# Altium schematic sheet efm32_1.SchDoc
size Letter
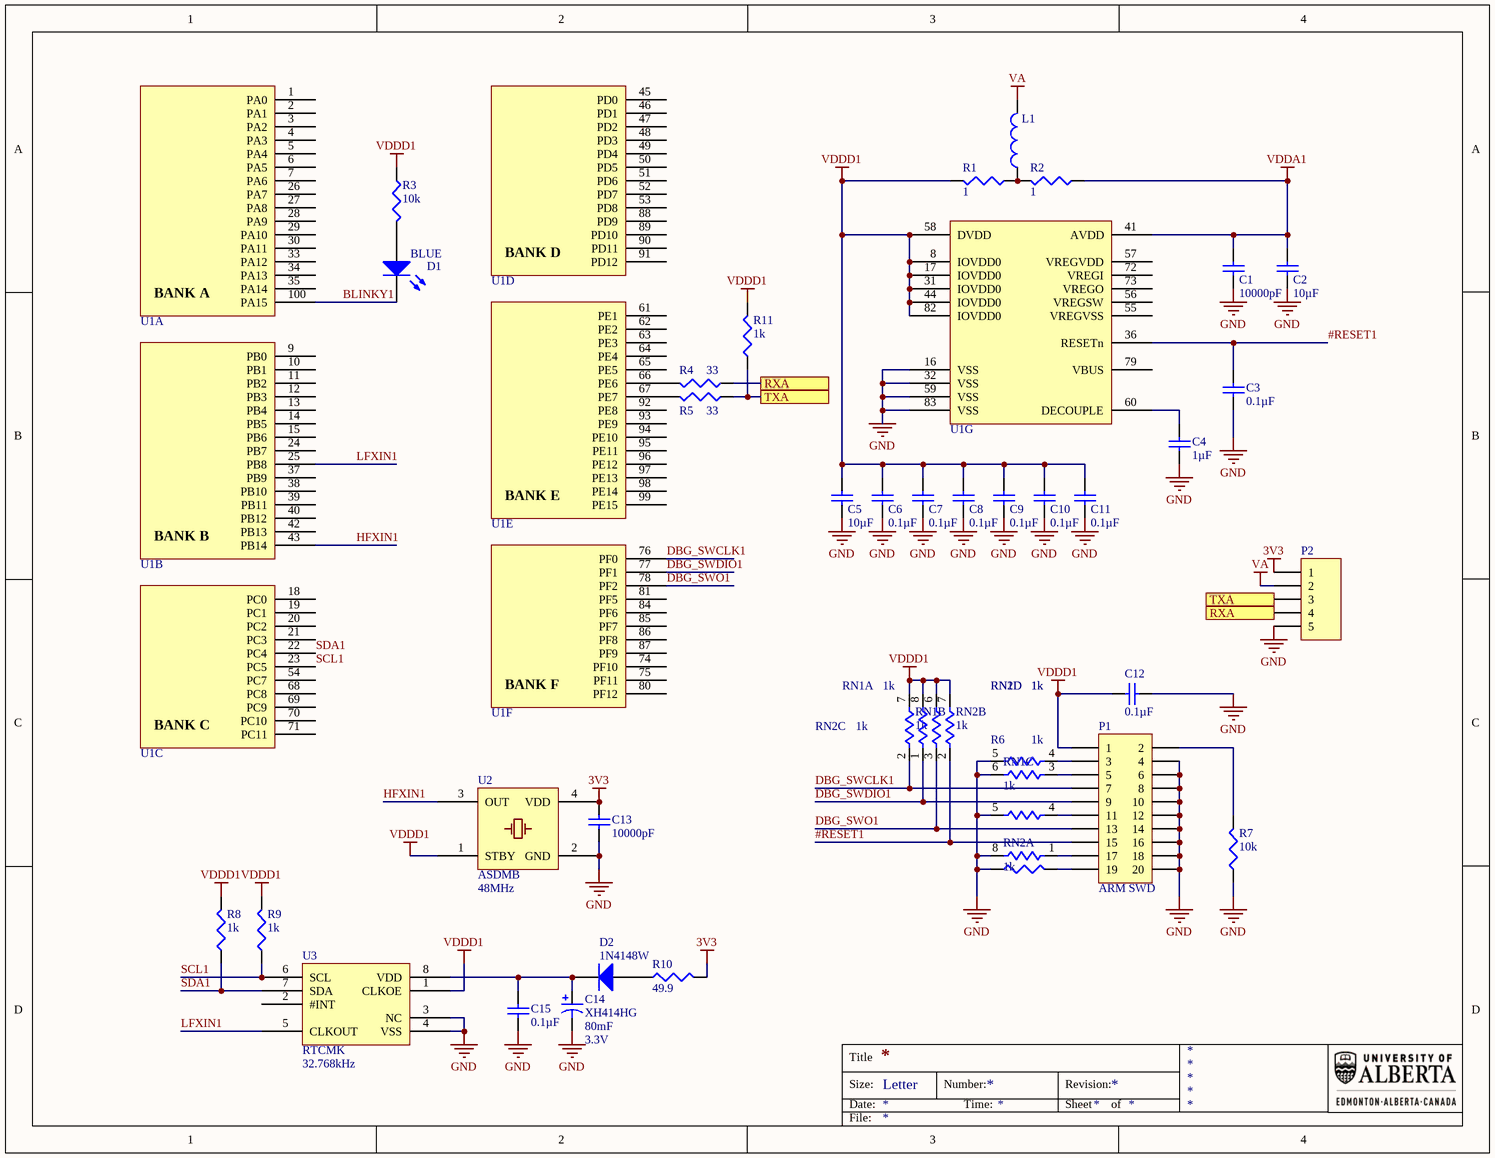
[diagram p0: efm32_1.SchDoc]

## Parts
C1  value 10000pF  [TDK-CGA3E]  (hidden comment: Cap)
C2  value 10µF  [TDK-CGA5L]  (hidden comment: Cap)
C3  value 0.1µF  [TDK-CGA3E]  (hidden comment: Cap)
C4  value 1µF  [TDK-CGA3E]  (hidden comment: Cap)
C5  value 10µF  [TDK-CGA5L]  (hidden comment: Cap)
C6  value 0.1µF  [TDK-CGA3E]  (hidden comment: Cap)
C7  value 0.1µF  [TDK-CGA3E]  (hidden comment: Cap)
C8  value 0.1µF  [TDK-CGA3E]  (hidden comment: Cap)
C9  value 0.1µF  [TDK-CGA3E]  (hidden comment: Cap)
C10  value 0.1µF  [TDK-CGA3E]  (hidden comment: Cap)
C11  value 0.1µF  [TDK-CGA3E]  (hidden comment: Cap)
C12  value 0.1µF  [TDK-CGA3E]  (hidden comment: Cap)
C13  value 10000pF  [TDK-CGA3E]  (hidden comment: Cap)
C14  XH414HG  value 80mF  Voltage - Rated: 3.3V  [SKI-XH414HG-IV01E]
C15  value 0.1µF  [TDK-CGA3E]  (hidden comment: Cap)
D1  value BLUE  [WL-150060XS75000]  (hidden comment: LED)
D2  1N4148W  [DIOD-SOD123]
L1  Inductor  [TDK-MPX1608]  (value not drawn)
P1  Header 10x2  [SLN-GRPB102]  (value not drawn)
P2  319-10-105-30-054000  [319-10-105-30-054000]  (value not drawn)
R1  value 1  [VSH-0603MCT]  (hidden comment: Res3)
R2  value 1  [VSH-0603MCT]  (hidden comment: Res3)
R3  value 10k  [PANA-ERJ3EK]  (hidden comment: Res3)
R4  value 33  [PANA-ERJ3EK]  (hidden comment: Res3)
R5  value 33  [PANA-ERJ3EK]  (hidden comment: Res3)
R6  value 1k  [PANA-ERJ3EK]  (hidden comment: Res3)
R7  value 10k  [PANA-ERJ3EK]  (hidden comment: Res3)
R8  value 1k  [PANA-ERJ3EK]  (hidden comment: Res3)
R9  value 1k  [PANA-ERJ3EK]  (hidden comment: Res3)
R10  value 49.9  [PANA-ERJ3EK]  (hidden comment: Res3)
R11  value 1k  [PANA-ERJ3EK]  (hidden comment: Res3)
RN1  value 1k  [PANA-EXB1206]  (hidden comment: Res4 Pack1)  (parts A,B,C,D of 4)
RN2  value 1k  [PANA-EXB1206]  (hidden comment: Res4 Pack1)  (parts A,B,C,D of 4)
U1  EFM32GG11B8  [SI-TQFP100]  (value not drawn)  (parts A,B,C,D,E,F,G of 7)
U2  ASDMB  value 48MHz  [ABR-ASDMB]
U3  RTCMK  value 32.768kHz  [ABR-RTCMK]

## Ports
RXA, TXA

## Nets
3V3: C13.2 P2.1 R10.2 U2.4(VDD)
GND: C1.1 C2.1 C3.2 C4.1 C5.1 C6.1 C7.1 C8.1 C9.1 C10.1 C11.1 C12.2 C13.1 C14.2 C15.1 P1.4 P1.6 P1.8 P1.10 P1.12 P1.14 P1.16 P1.18 P1.20 P2.5 R6.2 R7.1 RN1.5 RN1.6 RN2.5 RN2.8 U1.16(VSS) U1.32(VSS) U1.59(VSS) U1.83(VSS) U2.2(GND) U3.3(NC) U3.4(VSS)
VA: L1.2 P2.2
VDDA1: C1.2 C2.2 R2.1 U1.41(AVDD)
VDDD1: C5.2 C6.2 C7.2 C8.2 C9.2 C10.2 C11.2 C12.1 P1.1 R1.2 R3.2 R8.2 R9.2 R11.2 RN1.7 RN1.8 RN2.6 RN2.7 U1.8(IOVDD0) U1.17(IOVDD0) U1.31(IOVDD0) U1.44(IOVDD0) U1.58(DVDD) U1.82(IOVDD0) U2.1(STBY) U3.1(CLKOE)
#RESET1: C3.1 P1.15 RN2.2 U1.36(RESETn)
BLINKY1: D1.2(K) U1.100(PA15)
DBG_SWCLK1: P1.7 RN1.2 U1.76(PF0)
DBG_SWDIO1: P1.9 RN1.1 U1.77(PF1)
DBG_SWO1: P1.13 RN2.3 U1.78(PF2)
HFXIN1: U1.43(PB14) U2.3(OUT)
LFXIN1: U1.25(PB8) U3.5(CLKOUT)
RXA: P2.4 R4.1 ; port RXA
SCL1: R9.1 U1.23(PC5) U3.6(SCL)
SDA1: R8.1 U1.22(PC4) U3.7(SDA)
TXA: P2.3 R5.1 R11.1 ; port TXA
NetC4_2: C4.2 U1.60(DECOUPLE)
NetC14_1: C14.1 C15.2 D2.2(K) U3.8(VDD)
NetD1_1: D1.1(A) R3.1
NetD2_1: D2.1(A) R10.1
NetL1_1: L1.1 R1.1 R2.2
NetP1_2: P1.2 R7.2
NetP1_3: P1.3 RN1.4
NetP1_5: P1.5 RN1.3
NetP1_11: P1.11 RN2.4
NetP1_17: P1.17 RN2.1
NetP1_19: P1.19 R6.1
NetR4_2: R4.2 U1.66(PE6)
NetR5_2: R5.2 U1.67(PE7)

Not connected (* = marked no-connect by the designer): U1 1(PA0) 2(PA1) 3(PA2) 4(PA3) 5(PA4) 6(PA5) 7(PA6) 9(PB0) 10(PB1) 11(PB2) 12(PB3) 13(PB4) 14(PB5) 15(PB6) 18(PC0) 19(PC1) 20(PC2) 21(PC3) 24(PB7) 26(PA7) 27(PA8) 28(PA9) 29(PA10) 30(PA11) 33(PA12) 34(PA13) 35(PA14) 37(PB9) 38(PB10) 39(PB11) 40(PB12) 42(PB13) 45(PD0) 46(PD1) 47(PD2) 48(PD3) 49(PD4) 50(PD5) 51(PD6) 52(PD7) 53(PD8) 54(PC7) 55(VREGVSS) 56(VREGSW) 57(VREGVDD) 61(PE1) 62(PE2) 63(PE3) 64(PE4) 65(PE5) 68(PC8) 69(PC9) 70(PC10) 71(PC11) 72(VREGI) 73(VREGO) 74(PF10) 75(PF11) 79(VBUS) 80(PF12) 81(PF5) 84(PF6) 85(PF7) 86(PF8) 87(PF9) 88(PD9) 89(PD10) 90(PD11) 91(PD12) 92(PE8) 93(PE9) 94(PE10) 95(PE11) 96(PE12) 97(PE13) 98(PE14) 99(PE15); U3 2(#INT)

## Notes on the sheet
- (near P1) ARM SWD
- Title
- Size:
- Date:
- Letter
- Number:
- Time:
- Revision:
- Sheet
- of
- File:
- (in symbol PU-SI-00008, part A) BANK A
- (in symbol PU-SI-00008, part B) BANK B
- (in symbol PU-SI-00008, part C) BANK C
- (in symbol PU-SI-00008, part D) BANK D
- (in symbol PU-SI-00008, part E) BANK E
- (in symbol PU-SI-00008, part F) BANK F

## Library data of the parts
C1 C13 = PC-TDK-01883: CAP CER 10000PF 100V C0G 0603; Manufacturer Part Number: CGA3E1C0G2A103J080AC; Index: 1883; Designator: C?; Tolerance: ±5%; Temperature Coefficient: NP0; Published: 3/16/2016; LatestRevisionDate: 3/16/2016; LatestRevisionNote: ...; PackageReference: 0603 (1608 Metric); Publisher: AlbertaSat; PackageDescription: Radial Cap, Thru-Hole; 2 Leads; 0.3 in Pin Spacing; Part Number: PC-TDK-01883; Supplier Part Number 1: 445-172688-1-ND; Supplier 1: Digi-key; Supplier Link: http://www.digikey.ca/product-search/en?keywords=445-172688-1-ND; Voltage - Rated: 100V; Applications: Automotive
C2 C5 = PC-TDK-02917: CAP CER 10UF 25V X7R 1206; Manufacturer Part Number: CGA5L1X7R1E106K160AC; Index: 2917; Tolerance: ±10%; Published: 3/16/2016; LatestRevisionDate: 3/16/2016; LatestRevisionNote: ...; PackageReference: 1206 (3216 Metric); Publisher: AlbertaSat; PackageDescription: Radial Cap, Thru-Hole; 2 Leads; 0.3 in Pin Spacing; Part Number: PC-TDK-02917; Supplier Part Number 1: 445-6990-1-ND; Supplier 1: Digi-key; Supplier Link: http://www.digikey.ca/product-search/en?keywords=445-6990-1-ND; Voltage - Rated: 25V; Temperature Coefficient: X7R; Applications: Automotive
C3 C6-C12 C15 = PC-TDK-02272: CAP CER 0.1UF 50V X8R 0603; Manufacturer Part Number: CGA3E3X8R1H104K080AB; Index: 2272; Tolerance: ±10%; Published: 3/16/2016; LatestRevisionDate: 3/16/2016; LatestRevisionNote: ...; PackageReference: 0603 (1608 Metric); Publisher: AlbertaSat; PackageDescription: Radial Cap, Thru-Hole; 2 Leads; 0.3 in Pin Spacing; Part Number: PC-TDK-02272; Supplier Part Number 1: 445-12606-1-ND; Supplier 1: Digi-key; Supplier Link: http://www.digikey.ca/product-search/en?keywords=445-12606-1-ND; Voltage - Rated: 50V; Temperature Coefficient: X8R; Applications: Automotive
C4 = PC-TDK-02603: CAP CER 1UF 25V X7R 0603; Manufacturer Part Number: CGA3E1X7R1E105K080AC; Index: 2603; Designator: C?; Tolerance: ±10%; Published: 3/16/2016; LatestRevisionDate: 3/16/2016; LatestRevisionNote: ...; PackageReference: 0603 (1608 Metric); Publisher: AlbertaSat; PackageDescription: Radial Cap, Thru-Hole; 2 Leads; 0.3 in Pin Spacing; Part Number: PC-TDK-02603; Supplier Part Number 1: 445-6931-1-ND; Supplier 1: Digi-key; Supplier Link: http://www.digikey.ca/product-search/en?keywords=445-6931-1-ND; Voltage - Rated: 25V; Temperature Coefficient: X7R; Applications: Automotive
C14 = PC-SKI-00001: CAP 80MF 3.3V SURFACE MOUNT; Manufacturer Part Number: XH414HG-IV01E; Index: 1; Designator: C?; Published: 2018-04-25; LatestRevisionDate: 2018-04-25; LatestRevisionNote: ...; PackageReference: 0.189" Dia (4.80mm); Publisher: AlbertaSat; PackageDescription: Polarized Capacitor (Radial); 2 Leads; Part Number: PC-SKI-00001; Supplier Part Number 1: 728-1050-1-ND; Supplier 1: Digi-key; Supplier Part Number 2: 628-XH414HG-IV01E; Supplier 2: Mouser; Supplier Link: #https://www.digikey.ca/product-detail/en/seiko-instruments/XH414HG-IV01E/728-1050-1-ND/1889211#
D1 = 4: LED BLUE CLEAR 0603 SMD; Part Number: 4; Manufacturer Part Number: 150060BS75000; Designator: D?; Brightness: 145mcd; Published: 8-Jun-2000; LatestRevisionDate: 08-Jul-2005; LatestRevisionNote: Mech Layer 1 removed.; PackageReference: WL-150060XS75000; Publisher: Altium Limited; PackageDescription: LED; 2 Leads; Supplier Part Number 1: 732-4966-1-ND; Supplier 1: Digi-Key; Supplier Link: http://www.digikey.ca/product-search/en?keywords=732-4966-1-ND
D2 = 26: DIODE GEN PURP 100V 300MA SOD123; Part Number: 26; Manufacturer Part Number: 1N4148W-7-F; Designator: D?; Voltage - DC Reverse: 1.25V @ 150mA; Published: 8-Jun-2000; LatestRevisionDate: 17-Jul-2002; LatestRevisionNote: Re-released for DXP Platform.; PackageVersion: Sep-1996; PackageReference: DIOD-SOD123; Publisher: Altium Limited; PackageDescription: DO-214-AB/SMC; 2 C-Bend Leads; Body 7.9 x 5.9 mm, inc. leads (LxW); Code_JEDEC: DO-214-AB; Supplier Part Number 1: 1N4148W-FDICT-ND; Supplier 1: Digi-Key; Supplier Link: #https://www.digikey.ca/product-detail/en/diodes-incorporated/1N4148W-7-F/1N4148W-FDICT-ND/815280#; Voltage - Reverse Standoff (Typ): 100V; Current - Peak Pulse: 300mA
L1 = PL-TDK-02954: FERRITE BEAD 1 KOHM 0603 1LN; Manufacturer Part Number: MPZ1608S102ATD25; Code_IEC: 1608; Value: 1 kOhm @ 100MHz; Index: 2954; Designator: L?; Current - Rated: 800mA; Published: 7/8/2017; LatestRevisionDate: 7/8/2017; LatestRevisionNote: ...; PackageReference: 0603 (1608 Metric); Publisher: AlbertaSat; PackageDescription: Chip Inductor, 2-Leads, Body 1.60x0.80mm, IPC Low Density; Code_JEITA: 0603; Part Number: PL-TDK-02954; Supplier Part Number 1: 445-172890-1-ND; Supplier 1: Digi-key; Supplier Part Number 2: 810-MPZ1608S102ATD25; Supplier 2: Mouser; Supplier Link: #https://www.digikey.ca/product-detail/en/tdk-corporation/MPZ1608S102ATD25/445-172890-1-ND/5040521#; Applications: Automotive
P1 = PP-SLN-00022: CONN HEADER .050"" 20PS DL PCB AU; Manufacturer Part Number: GRPB102VWVN-RC; Index: 22; Designator: P?; Number of Positions: 20; LatestRevisionDate: 3/16/2016; LatestRevisionNote: ...; Publisher: AlbertaSat; Part Number: PP-SLN-00022; Supplier Part Number 1: S9015E-10-ND; Supplier 1: Digi-key; Published: 3/16/2016; PackageReference: SLN-GRPB102; PackageDescription: CONN HEADER .050"" 20PS DL PCB AU; Supplier Link: http://www.digikey.ca/product-search/en?keywords=S9015E-10-ND; Number of Rows: 2
P2 = PP-MMM-00002: LOW PROFILE SLC TARGET CONNECTOR; Index: 2; Designator: P?; LatestRevisionDate: 2018-05-10; LatestRevisionNote: ...; Publisher: AlbertaSat; Part Number: PP-MMM-00002; Manufacturer Part Number: 319-10-105-30-054000; Supplier Part Number 1: ED10781-ND; Supplier 1: Digi-key; Supplier Part Number 2: 575-3191010530054000; Supplier 2: Mouser; Published: 2018-05-10; Supplier Link: #https://www.digikey.ca/product-detail/en/mill-max-manufacturing-corp/319-10-105-30-054000/ED10781-ND/6243896#
R1 R2 = PR-VSH-00048: RES SMD 1 OHM 1% 1/8W 0603; Manufacturer Part Number: MCT06030C1008FP500; Index: 4; Designator: R?; Temperature Coefficient: ±50ppm/°C; Published: 3/14/2016; LatestRevisionDate: 3/14/2016; LatestRevisionNote: ...; PackageReference: 0603 (1608 Metric); Publisher: AlbertaSat; PackageDescription: Chip Resistor, 2-Leads, Body 1.55x0.85mm, IPC Low Density; Part Number: PR-VSH-00048; Supplier Part Number 1: MCT0603-1.00-CFCT-ND; Supplier 1: Digi-key; Supplier Link: http://www.digikey.ca/product-search/en?keywords=MCT0603-1.00-CFCT-ND; Tolerance: ±1%; Power - Rated: 1/8W; Applications: General Purpose
R3 R7 = 17203: RES SMD 10K OHM 1% 1/10W 0603; Part Number: 17203; Manufacturer Part Number: ERJ-3EKF1002V; Designator: R?; Power: 0.1W, 1/10W; Temperature Coefficient: ±100ppm/°C; Published: 8-Jun-2000; LatestRevisionDate: 29-May-2009; LatestRevisionNote: IPC-7351 Footprint Added.; PackageReference: 0603 (1608 Metric); Publisher: Altium Limited; PackageDescription: Chip Resistor, 2-Leads, Body 1.60x0.80mm, IPC Low Density; Supplier Part Number 1: P10.0KHCT-ND; Supplier 1: Digi-Key; Supplier Link: http://www.digikey.ca/product-search/en?keywords=P10.0KHCT-ND; Tolerance: ±1%
R4 R5 = 13588: RES SMD 33 OHM 1% 1/10W 0603; Part Number: 13588; Manufacturer Part Number: ERJ-3EKF33R0V; Designator: R?; Power: 0.1W, 1/10W; Temperature Coefficient: ±100ppm/°C; Published: 8-Jun-2000; LatestRevisionDate: 29-May-2009; LatestRevisionNote: IPC-7351 Footprint Added.; PackageReference: 0603 (1608 Metric); Publisher: Altium Limited; PackageDescription: Chip Resistor, 2-Leads, Body 1.60x0.80mm, IPC Low Density; Supplier Part Number 1: P33.0HCT-ND; Supplier 1: Digi-Key; Supplier Link: http://www.digikey.ca/product-search/en?keywords=P33.0HCT-ND; Tolerance: ±1%
R6 R8 R9 R11 = 15398: RES SMD 1K OHM 1% 1/10W 0603; Part Number: 15398; Manufacturer Part Number: ERJ-3EKF1001V; Designator: R?; Power: 0.1W, 1/10W; Temperature Coefficient: ±100ppm/°C; Published: 8-Jun-2000; LatestRevisionDate: 29-May-2009; LatestRevisionNote: IPC-7351 Footprint Added.; PackageReference: 0603 (1608 Metric); Publisher: Altium Limited; PackageDescription: Chip Resistor, 2-Leads, Body 1.60x0.80mm, IPC Low Density; Supplier Part Number 1: P1.00KHCT-ND; Supplier 1: Digi-Key; Supplier Link: http://www.digikey.ca/product-search/en?keywords=P1.00KHCT-ND; Tolerance: ±1%
R10 = 13734: RES SMD 49.9 OHM 1% 1/10W 0603; Part Number: 13734; Manufacturer Part Number: ERJ-3EKF49R9V; Designator: R?; Power: 0.1W, 1/10W; Temperature Coefficient: ±100ppm/°C; Published: 8-Jun-2000; LatestRevisionDate: 29-May-2009; LatestRevisionNote: IPC-7351 Footprint Added.; PackageReference: 0603 (1608 Metric); Publisher: Altium Limited; PackageDescription: Chip Resistor, 2-Leads, Body 1.60x0.80mm, IPC Low Density; Supplier Part Number 1: P49.9HCT-ND; Supplier 1: Digi-Key; Supplier Link: http://www.digikey.ca/product-search/en?keywords=P49.9HCT-ND; Tolerance: ±1%
RN1 RN2 = 19830: RES ARRAY 4 RES 1K OHM 1206; Part Number: 19830; Manufacturer Part Number: EXB-38V102JV; Sim Note: Enter the Resistance value into parameter field.; Designator: RN?; Tolerance: ±5%; Power: 62.5mW; Temperature Coefficient: ±200ppm/°C; Code_JEDEC: MS-012-AC; Supplier Part Number 1: Y9102CT-ND; Supplier 1: Digi-Key; Supplier Link: http://www.digikey.ca/product-search/en?keywords=Y9102CT-ND; PackageReference: 1206 (3216 Metric), Convex, Long Side Terminals; PackageDescription: Chip Array, ConvexS, 8-Leads, Pitch 0.80mm,  Body 3.20x1.60mm,  IPC Low Density
U1 = PU-SI-00008: GIANT GECKO 11 ULTRA LOW POWER M; Manufacturer Part Number: EFM32GG11B820F2048GQ100-A; Index: 8; Designator: U?; Core Processor: ARM Cortex-M4; Core Size: 32-Bit; Speed: 72MHz; Program Memory Size: 2MB (2M x 8); RAM Size: 512K x 8; Part Number: PU-SI-00008; Supplier Part Number 1: 336-4515-ND; Supplier 1: Digi-key; Supplier Part Number 2: 634-11820F2048GQ100; Supplier 2: Mouser; Publisher: AlbertaSat; Published: 4/18/2018; LatestRevisionDate: 4/18/2018; LatestRevisionNote: ...; PackageReference: SI-TQFP100; PackageDescription: TSQFP, 100-Leads, Body 14.00x14.00mm, Pitch 0.50mm, IPC Low Density; Supplier Link: https://www.digikey.ca/products/en?keywords=336-4515-ND; Applications: General Purpose; Operating Temperature: -40°C ~ 85°C (TA)
U2 = PU-ABR-00029: OSC MEMS 48.000MHZ CMOS SMD; Manufacturer Part Number: ASDMB-48.000MHZ-XY-T; Index: 29; Designator: U?; Tolerance: ±10ppm; Part Number: PU-ABR-00029; Supplier Part Number 1: 535-11144-1-ND; Supplier 1: Digi-key; Supplier Part Number 2: 815-ASDMB-48-XY-T; Supplier 2: Mouser; Publisher: AlbertaSat; Published: 10/24/2017; LatestRevisionDate: 10/24/2017; LatestRevisionNote: ...; PackageReference: 4-SMD, No Lead; PackageDescription: DFN, 4-Leads, Body 2.00x2.50mm, Pitch 1.65mm, IPC Low Density; Supplier Link: http://www.digikey.ca/product-search/en?keywords=535-11144-1-ND
U3 = PU-ABR-00037: IC RTC CLK/CALENDAR I2C 8-SMT; Manufacturer Part Number: AB-RTCMK-32.768KHZ-T3; Index: 37; Designator: U?; Part Number: PU-ABR-00037; Supplier Part Number 1: 535-11916-1-ND; Supplier 1: Digi-key; Supplier Part Number 2: 815-AB-RTCMK-32.7KT3; Supplier 2: Mouser; Publisher: AlbertaSat; Published: 4/23/2018; LatestRevisionDate: 4/23/2018; LatestRevisionNote: ...; PackageReference: 8-SMD Module; PackageDescription: 8-SMD Module; Supplier Link: https://www.digikey.ca/product-detail/en/abracon-llc/AB-RTCMK-32.768KHZ-T3/535-11916-1-ND/3601050